# EAGLE design IOIO Pump Unrouted (EAGLE 6.3)
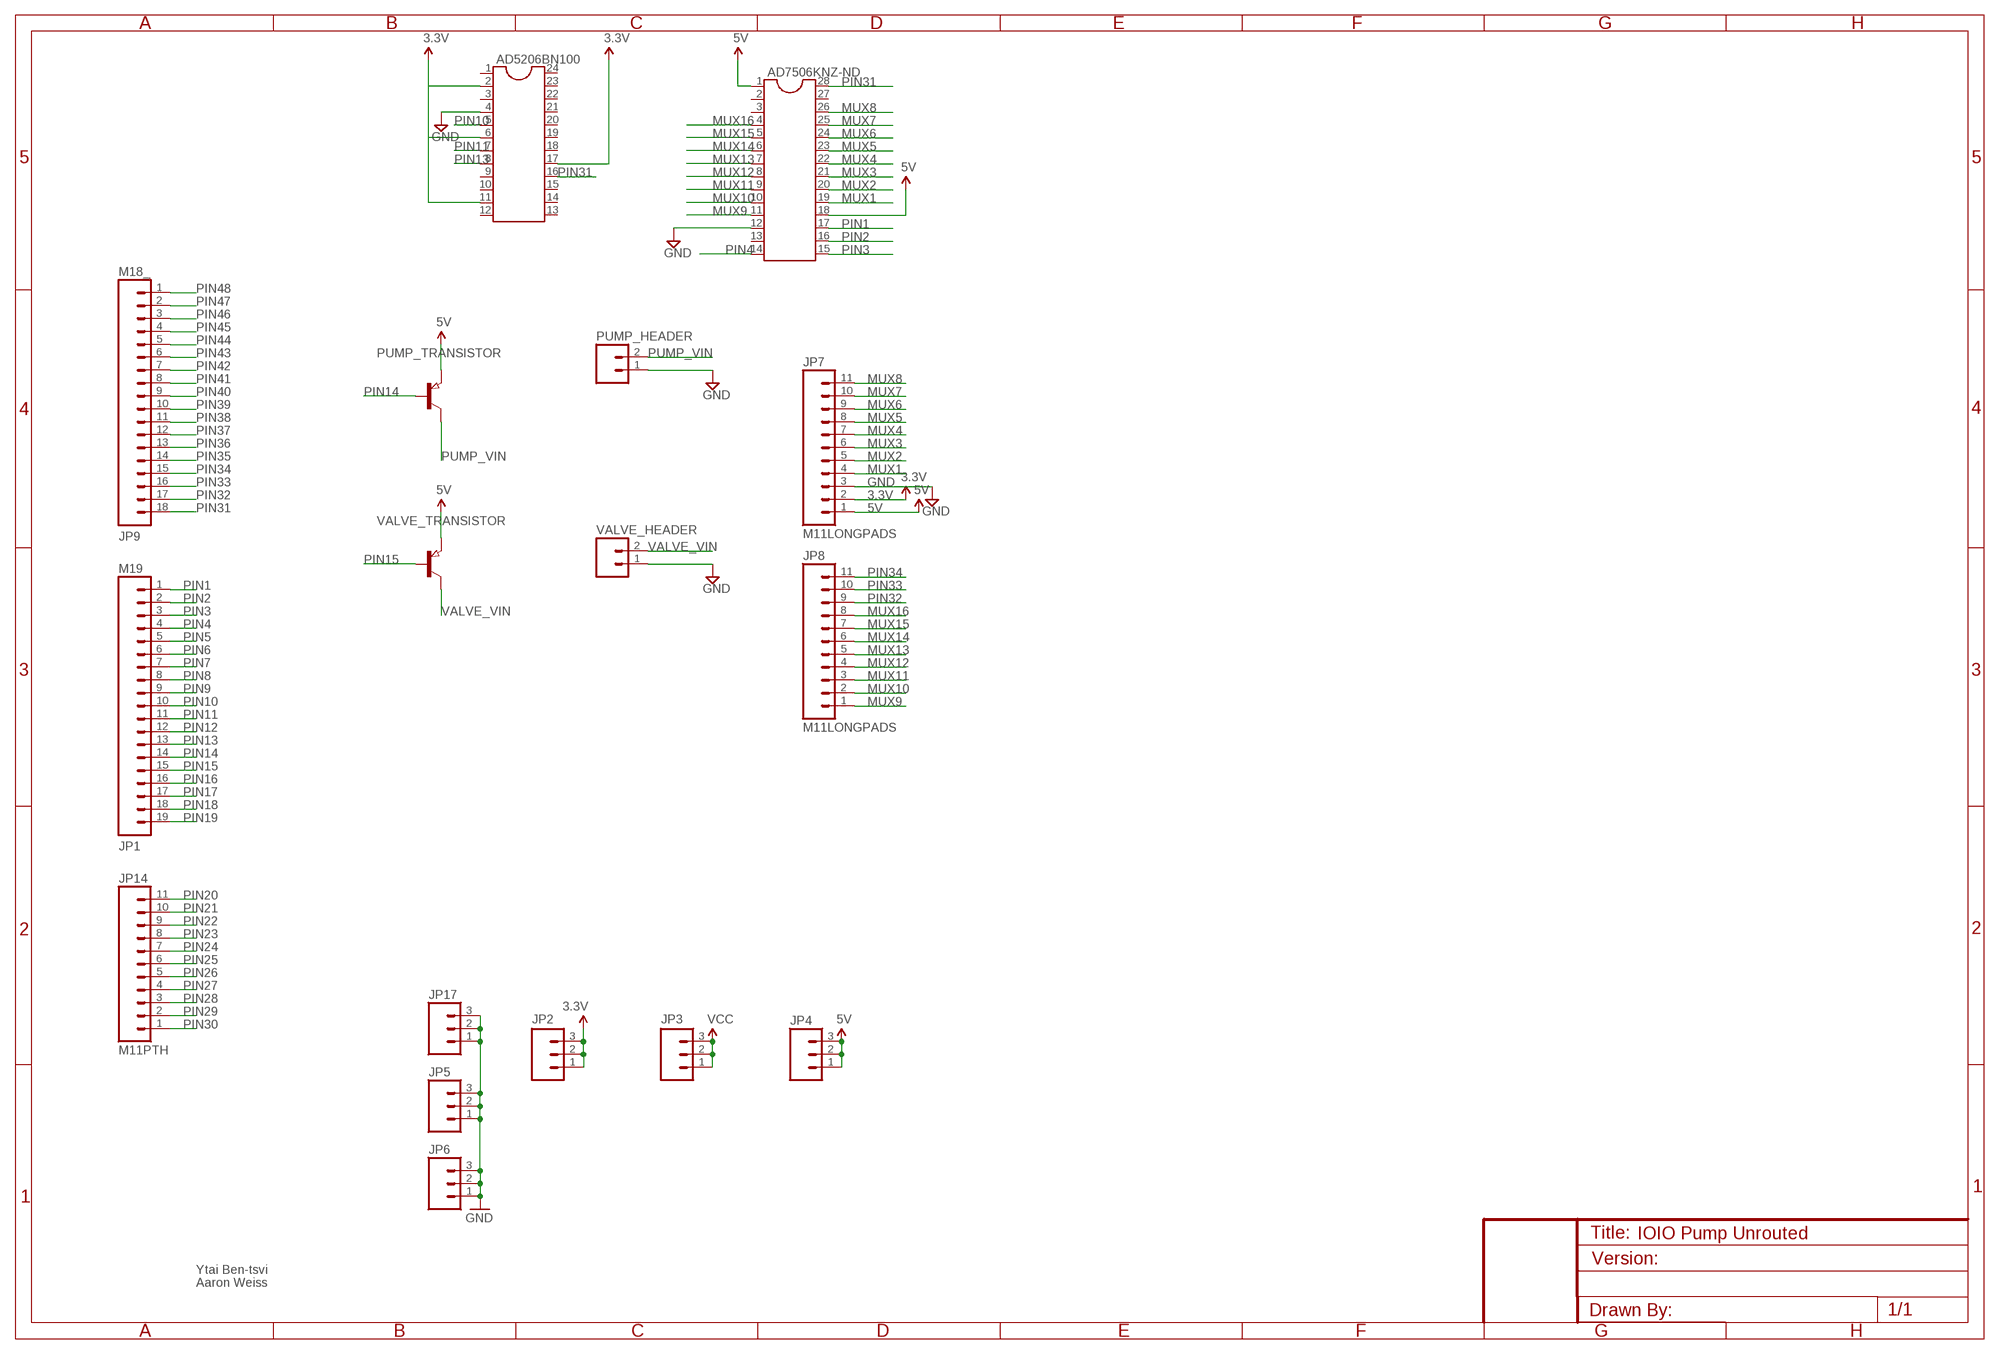
[diagram p0: schematic, sheet 1]

## Parts
AD5206BN100  DIL24-3  [DIL24-3]
AD7506KNZ-ND  DIL28  [DIL28-6]
JP1  M19  [1X19]
JP2  M03PTH  [1X03]
JP3  M03PTH  [1X03]
JP4  M03PTH  [1X03]
JP5  M03PTH  [1X03]
JP6  M03PTH  [1X03]
JP7  M11LONGPADS  [1X11_LONGPADS]
JP8  M11LONGPADS  [1X11_LONGPADS]
JP9  M18_  [1X18]
JP14  M11PTH  [1X11]
JP17  M03PTH  [1X03]
PUMP_HEADER  M02PTH  [1X02]
PUMP_TRANSISTOR  PNP-TRANSISTOR_SOT23  [SOT23]
VALVE_HEADER  M02PTH  [1X02]
VALVE_TRANSISTOR  PNP-TRANSISTOR_SOT23  [SOT23]

## Nets
3.3V: AD5206BN100.2 AD5206BN100.6 AD5206BN100.11 AD5206BN100.17 JP2.1 JP2.2 JP2.3 JP7.2
5V: AD7506KNZ-ND.1 AD7506KNZ-ND.18 JP4.1 JP4.2 JP4.3 JP7.1 PUMP_TRANSISTOR.2(E) VALVE_TRANSISTOR.2(E)
GND: AD5206BN100.4 AD7506KNZ-ND.12 JP5.1 JP5.2 JP5.3 JP6.1 JP6.2 JP6.3 JP7.3 JP17.1 JP17.2 JP17.3 PUMP_HEADER.1 VALVE_HEADER.1
MUX1: AD7506KNZ-ND.19 JP7.4
MUX2: AD7506KNZ-ND.20 JP7.5
MUX3: AD7506KNZ-ND.21 JP7.6
MUX4: AD7506KNZ-ND.22 JP7.7
MUX5: AD7506KNZ-ND.23 JP7.8
MUX6: AD7506KNZ-ND.24 JP7.9
MUX7: AD7506KNZ-ND.25 JP7.10
MUX8: AD7506KNZ-ND.26 JP7.11
MUX9: AD7506KNZ-ND.11 JP8.1
MUX10: AD7506KNZ-ND.10 JP8.2
MUX11: AD7506KNZ-ND.9 JP8.3
MUX12: AD7506KNZ-ND.8 JP8.4
MUX13: AD7506KNZ-ND.7 JP8.5
MUX14: AD7506KNZ-ND.6 JP8.6
MUX15: AD7506KNZ-ND.5 JP8.7
MUX16: AD7506KNZ-ND.4 JP8.8
PIN1: AD7506KNZ-ND.17 JP1.1
PIN2: AD7506KNZ-ND.16 JP1.2
PIN3: AD7506KNZ-ND.15 JP1.3
PIN4: AD7506KNZ-ND.14 JP1.4
PIN5: JP1.5
PIN6: JP1.6
PIN7: JP1.7
PIN8: JP1.8
PIN9: JP1.9
PIN10: AD5206BN100.5 JP1.10
PIN11: AD5206BN100.7 JP1.11
PIN12: JP1.12
PIN13: AD5206BN100.8 JP1.13
PIN14: JP1.14 PUMP_TRANSISTOR.1(B)
PIN15: JP1.15 VALVE_TRANSISTOR.1(B)
PIN16: JP1.16
PIN17: JP1.17
PIN18: JP1.18
PIN19: JP1.19
PIN20: JP14.11
PIN21: JP14.10
PIN22: JP14.9
PIN23: JP14.8
PIN24: JP14.7
PIN25: JP14.6
PIN26: JP14.5
PIN27: JP14.4
PIN28: JP14.3
PIN29: JP14.2
PIN30: JP14.1
PIN31: AD5206BN100.16 AD7506KNZ-ND.28 JP9.18
PIN32: JP8.9 JP9.17
PIN33: JP8.10 JP9.16
PIN34: JP8.11 JP9.15
PIN35: JP9.14
PIN36: JP9.13
PIN37: JP9.12
PIN38: JP9.11
PIN39: JP9.10
PIN40: JP9.9
PIN41: JP9.8
PIN42: JP9.7
PIN43: JP9.6
PIN44: JP9.5
PIN45: JP9.4
PIN46: JP9.3
PIN47: JP9.2
PIN48: JP9.1
PUMP_VIN: PUMP_HEADER.2 PUMP_TRANSISTOR.3(C)
VALVE_VIN: VALVE_HEADER.2 VALVE_TRANSISTOR.3(C)
VCC: JP3.1 JP3.2 JP3.3
Unconnected: AD5206BN100.1 AD5206BN100.3 AD5206BN100.9 AD5206BN100.10 AD5206BN100.12 AD5206BN100.13 AD5206BN100.14 AD5206BN100.15 AD5206BN100.18 AD5206BN100.19 AD5206BN100.20 AD5206BN100.21 AD5206BN100.22 AD5206BN100.23 AD5206BN100.24 AD7506KNZ-ND.2 AD7506KNZ-ND.3 AD7506KNZ-ND.13 AD7506KNZ-ND.27

## Notes on the sheet
- Ytai Ben-tsvi
- Aaron Weiss

## Library data of the parts
AD5206BN100 = ic-package:DIL24: Dual In Line
AD7506KNZ-ND = ic-package:DIL28: Dual In Line
JP1 = SparkFun:M19
JP2-JP6 JP17 = SparkFun:M03: Header 3 Standard 3-pin 0.1" header. Use with straight break away headers (SKU : PRT-00116), right angle break away headers (PRT-00553), swiss pins (PRT-00743), machine pins (PRT-00117), and female headers (PRT-00115). Molex polarized connector foot print use with SKU : PRT-08232 with associated crimp pins and housings.
JP7 JP8 JP14 = SparkFun:M11: Header 11 Standard 11-pin 0.1" header. Use with straight break away headers (SKU : PRT-00116), right angle break away headers (PRT-00553), swiss pins (PRT-00743), machine pins (PRT-00117), and female headers (PRT-00115).
JP9 = SparkFun:M18
PUMP_HEADER VALVE_HEADER = SparkFun:M02: Header 2 Standard 2-pin 0.1" header. Use with straight break away headers (SKU : PRT-00116), right angle break away headers (PRT-00553), swiss pins (PRT-00743), machine pins (PRT-00117), and female headers (PRT-00115). Molex polarized connector foot print use with SKU : PRT-08233 with associated crimp pins and housings.
PUMP_TRANSISTOR VALVE_TRANSISTOR = semicon-smd-ipc:PNP-TRANSISTOR_: PNP TRANSISTOR

## Board
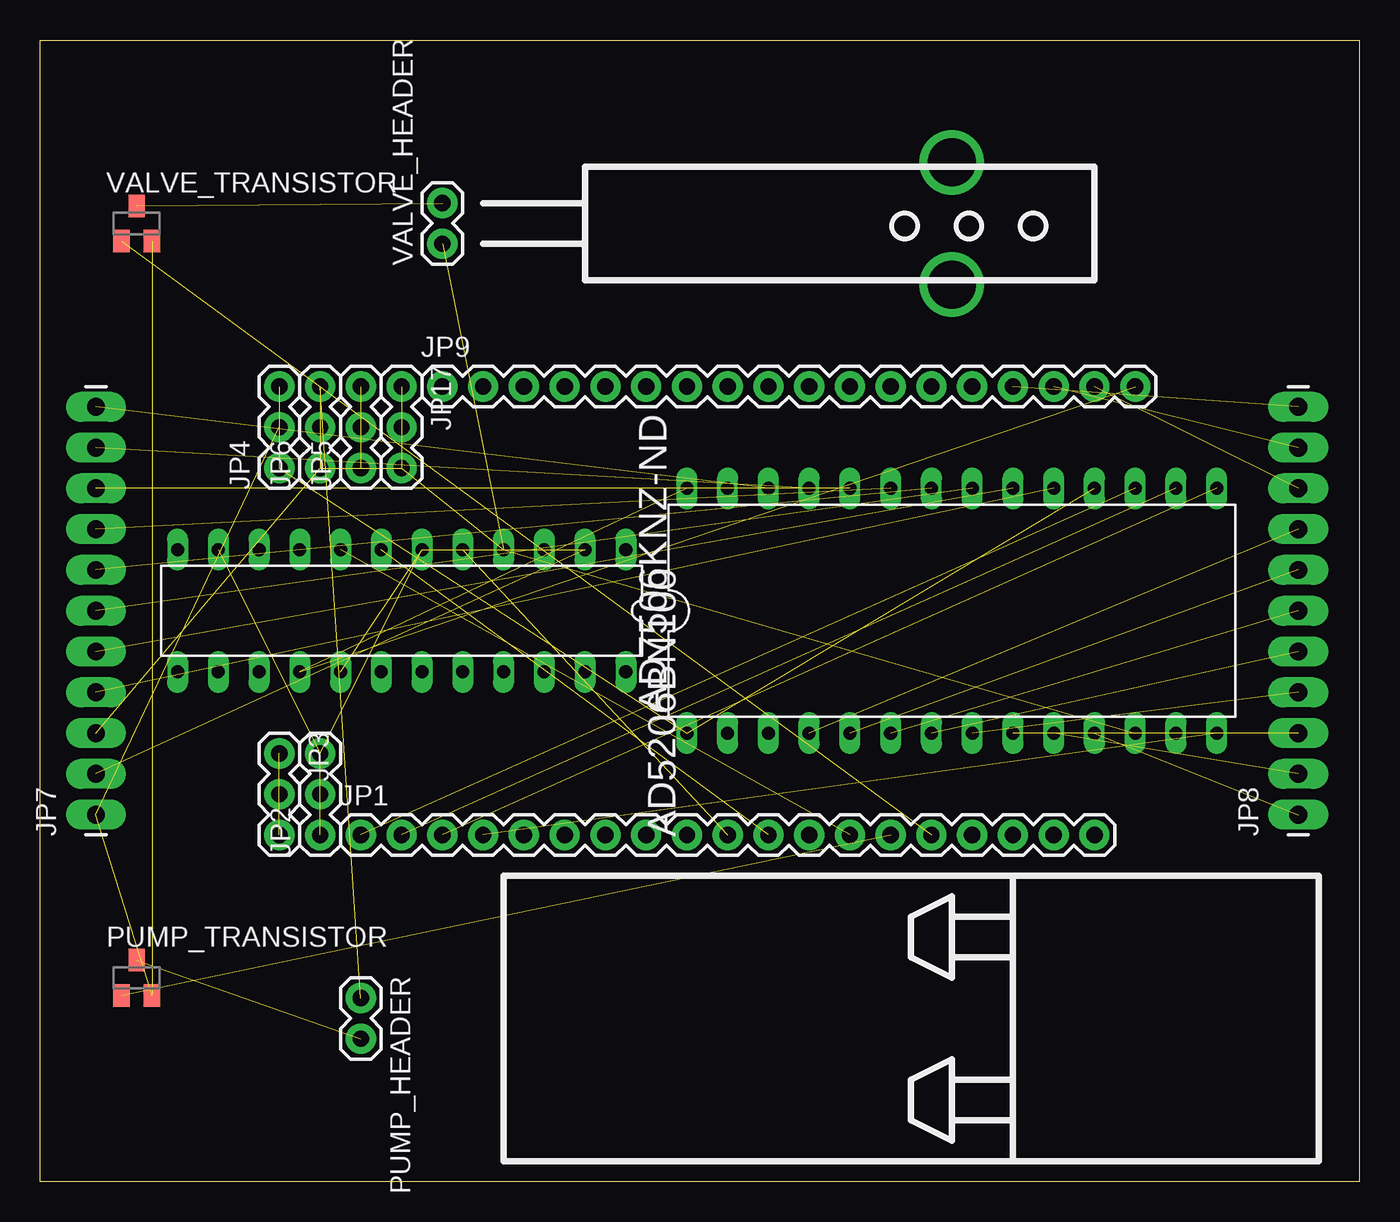
[diagram p1: board, top side]
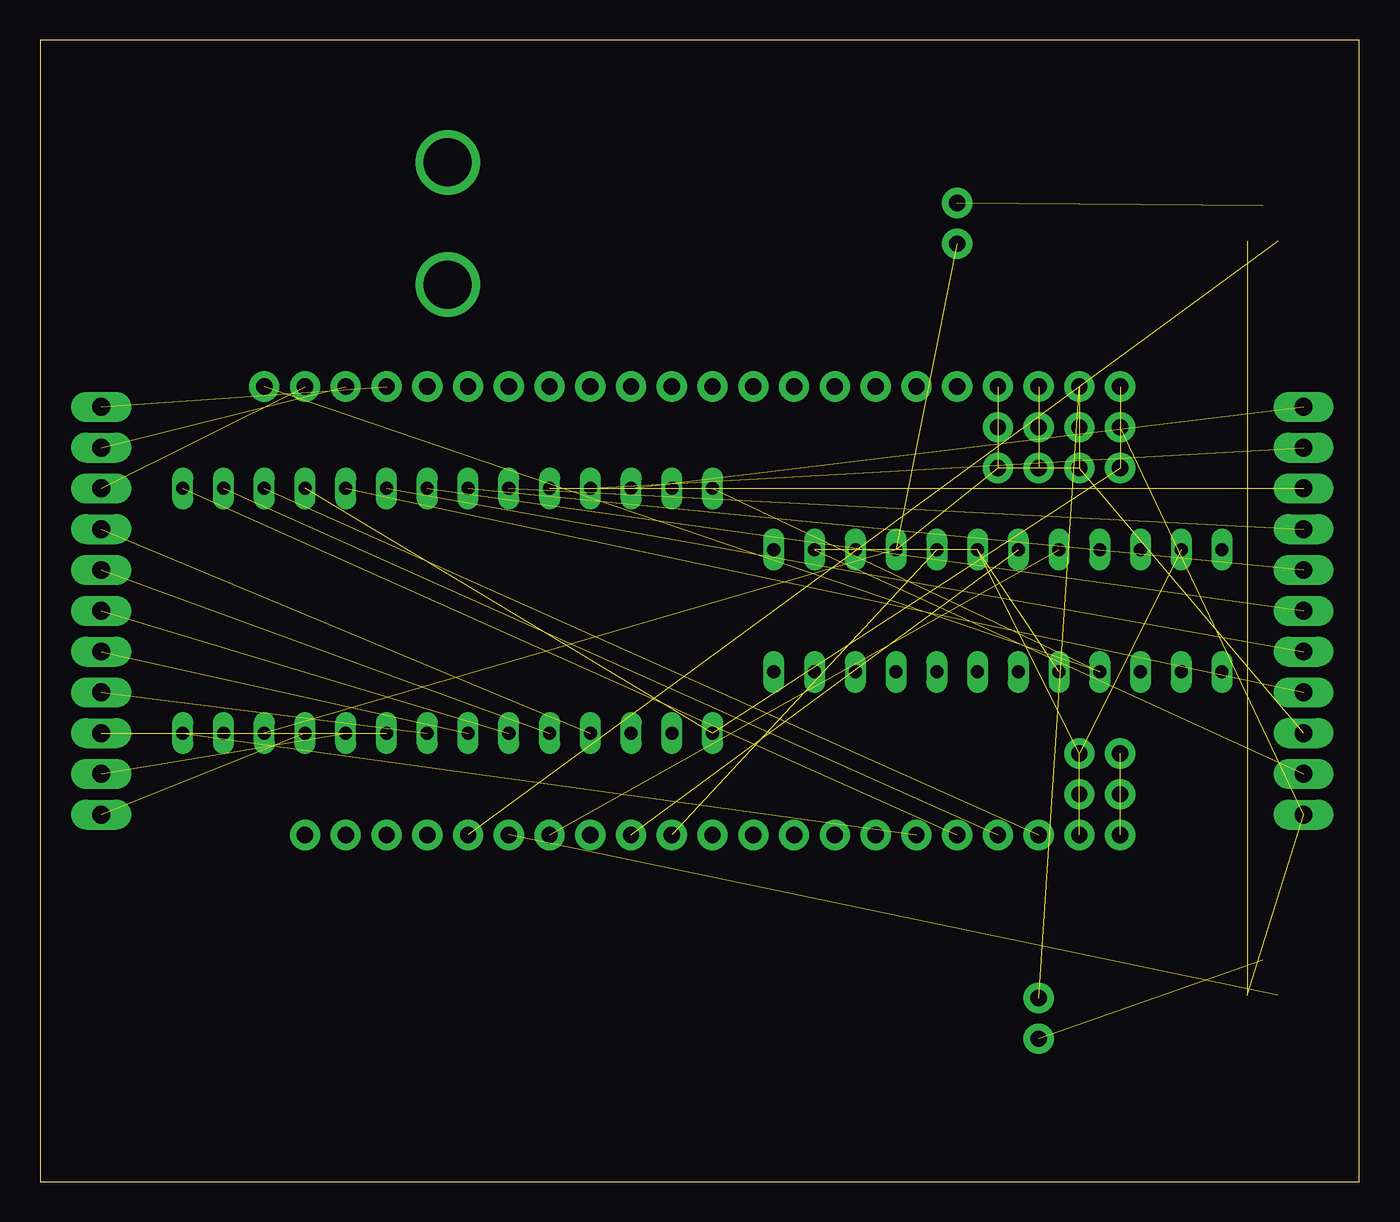
[diagram p2: board, bottom side, seen from below]

Size 82.22 x 71.11 mm. Coordinates in mm from the lower left corner, seen from the top.
Outline: 82.22,0 0,0 0,71.11 82.22,71.11 82.22,0
Copper layers (1*16): Top 0.035mm / dielectric 1.5mm / Bottom 0.035mm
Design rules "default": minimum track width 10mil, minimum drill 24mil, track to track 8mil, track to pad 8mil, pad to pad 8mil, via to via 8mil, smd to smd 8mil, copper to edge 40mil, drill to drill 8mil, minimum pad ring 10mil, minimum via ring 8mil, stop-mask expansion 4mil, vias tented up to drill 0mil, thermal gap 10mil

### Footprints (pad centres in the part's own frame; a part is rotated, then mirrored left to right if it is on the bottom)
DIL24-3 = drill 0.813 long: 1 -13.97,-3.81; 2 -11.43,-3.81; 3 -8.89,-3.81; 4 -6.35,-3.81; 5 -3.81,-3.81; 6 -1.27,-3.81; 7 1.27,-3.81; 8 3.81,-3.81; 9 6.35,-3.81; 10 8.89,-3.81; 11 11.43,-3.81; 12 13.97,-3.81; 13 13.97,3.81; 14 11.43,3.81; 15 8.89,3.81; 16 6.35,3.81; 17 3.81,3.81; 18 1.27,3.81; 19 -1.27,3.81; 20 -3.81,3.81; 21 -6.35,3.81; 22 -8.89,3.81; 23 -11.43,3.81; 24 -13.97,3.81
DIL28-6 = drill 0.813 long: 1 -16.51,-7.62; 2 -13.97,-7.62; 3 -11.43,-7.62; 4 -8.89,-7.62; 5 -6.35,-7.62; 6 -3.81,-7.62; 7 -1.27,-7.62; 8 1.27,-7.62; 9 3.81,-7.62; 10 6.35,-7.62; 11 8.89,-7.62; 12 11.43,-7.62; 13 13.97,-7.62; 14 16.51,-7.62; 15 16.51,7.62; 16 13.97,7.62; 17 11.43,7.62; 18 8.89,7.62; 19 6.35,7.62; 20 3.81,7.62; 21 1.27,7.62; 22 -1.27,7.62; 23 -3.81,7.62; 24 -6.35,7.62; 25 -8.89,7.62; 26 -11.43,7.62; 27 -13.97,7.62; 28 -16.51,7.62
1X19 = drill 1.016 pad 1.88: 1 0,0; 2 2.54,0; 3 5.08,0; 4 7.62,0; 5 10.16,0; 6 12.7,0; 7 15.24,0; 8 17.78,0; 9 20.32,0; 10 22.86,0; 11 25.4,0; 12 27.94,0; 13 30.48,0; 14 33.02,0; 15 35.56,0; 16 38.1,0; 17 40.64,0; 18 43.18,0; 19 45.72,0
1X03 = drill 1.016 pad 1.88: 1 0,0; 2 2.54,0; 3 5.08,0
1X11_LONGPADS = drill 1.118 pad 1.88 long: 1 0,0; 2 2.54,0; 3 5.08,0; 4 7.62,0; 5 10.16,0; 6 12.7,0; 7 15.24,0; 8 17.78,0; 9 20.32,0; 10 22.86,0; 11 25.4,0
1X18 = drill 1.016 pad 1.88: 1 0,0; 2 2.54,0; 3 5.08,0; 4 7.62,0; 5 10.16,0; 6 12.7,0; 7 15.24,0; 8 17.78,0; 9 20.32,0; 10 22.86,0; 11 25.4,0; 12 27.94,0; 13 30.48,0; 14 33.02,0; 15 35.56,0; 16 38.1,0; 17 40.64,0; 18 43.18,0
1X11 = drill 1.016 pad 1.88: 1 0,0; 2 2.54,0; 3 5.08,0; 4 7.62,0; 5 10.16,0; 6 12.7,0; 7 15.24,0; 8 17.78,0; 9 20.32,0; 10 22.86,0; 11 25.4,0
1X02 = drill 1.016 pad 1.88: 1 0,0; 2 2.54,0
SOT23 = smd 1 x 1.4: 1 -0.95,-1.1; 2 0.95,-1.1; 3 0,1.1

### Placement (x,y rotation side)
AD5206BN100  22.53,35.56 180 top
AD7506KNZ-ND  56.82,35.56 0 top
JP1  19.99,21.59 0 top
JP2  17.45,21.59 90 top
JP3  14.91,26.67 270 top
JP4  14.91,44.45 90 top
JP5  19.99,44.45 90 top
JP6  17.45,44.45 90 top
JP7  3.48,22.86 90 top
JP8  78.41,22.86 90 top
JP9  25.07,49.53 0 top
JP14  96.19,6.35 90 bottom  (outside the outline)
JP17  22.53,49.53 270 top
PUMP_HEADER  19.99,11.43 270 top
PUMP_TRANSISTOR  6.02,12.7 0 top
VALVE_HEADER  25.07,58.42 90 top
VALVE_TRANSISTOR  6.02,59.69 0 top

### Tracks (layer width: path | path; a pad name or v marks a point on that pad's centre or on a via)
3.3V  (7 unrouted)
5V  (7 unrouted)
GND  (13 unrouted)
MUX1  (1 unrouted)
MUX2  (1 unrouted)
MUX3  (1 unrouted)
MUX4  (1 unrouted)
MUX5  (1 unrouted)
MUX6  (1 unrouted)
MUX7  (1 unrouted)
MUX8  (1 unrouted)
MUX9  (1 unrouted)
MUX10  (1 unrouted)
MUX11  (1 unrouted)
MUX12  (1 unrouted)
MUX13  (1 unrouted)
MUX14  (1 unrouted)
MUX15  (1 unrouted)
MUX16  (1 unrouted)
N$1  (via drill 3)
  other vias: 56.82,55.88
N$2  (via drill 3)
  other vias: 56.82,63.5
PIN1  (1 unrouted)
PIN2  (1 unrouted)
PIN3  (1 unrouted)
PIN4  (1 unrouted)
PIN10  (1 unrouted)
PIN11  (1 unrouted)
PIN13  (1 unrouted)
PIN14  (1 unrouted)
PIN15  (1 unrouted)
PIN31  (2 unrouted)
PIN32  (1 unrouted)
PIN33  (1 unrouted)
PIN34  (1 unrouted)
PUMP_VIN  (1 unrouted)
VALVE_VIN  (1 unrouted)
VCC  (2 unrouted)